# EAGLE design INCLINOMETRO_12 (EAGLE 7.6.0)
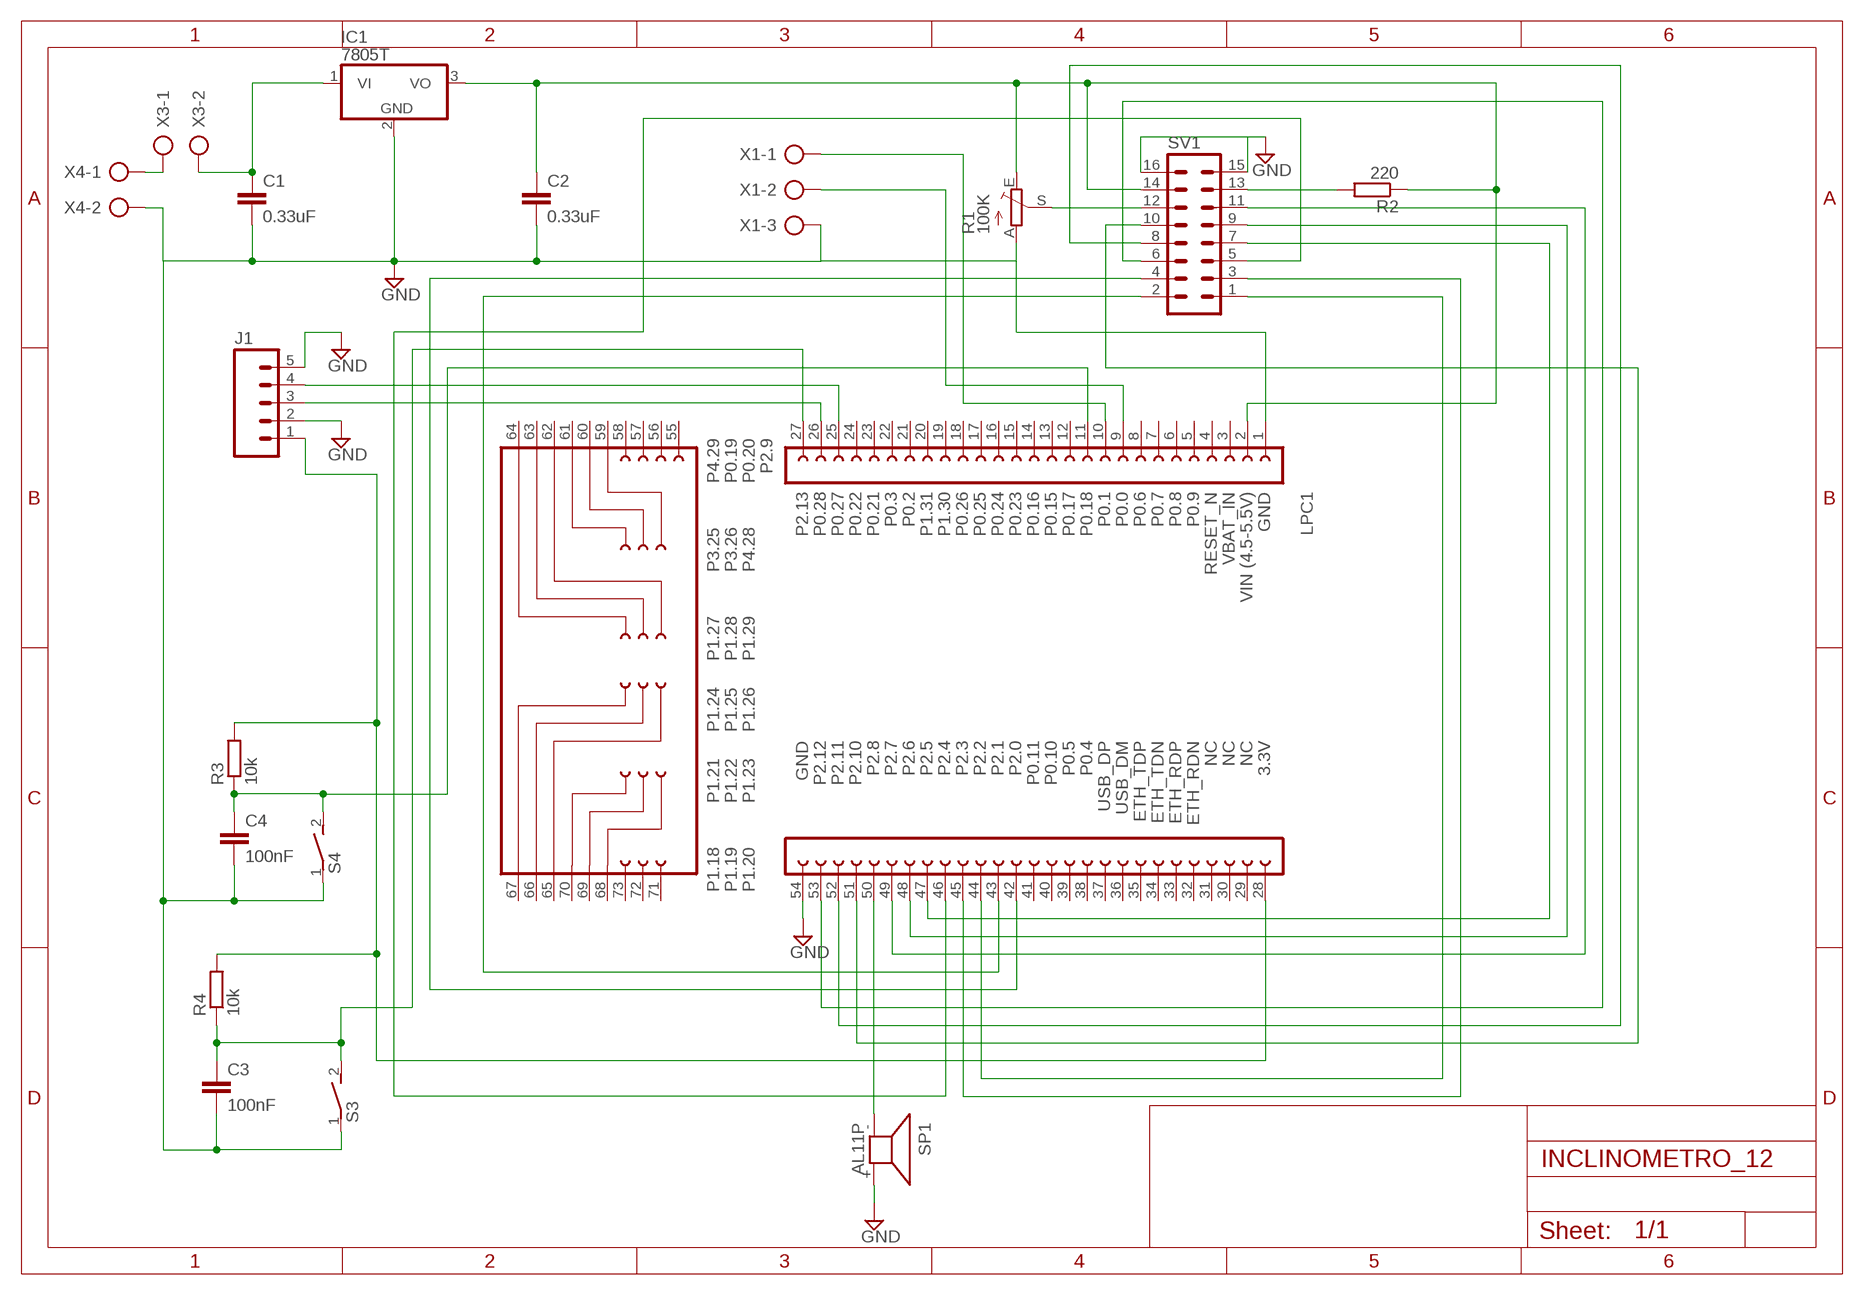
[diagram p0: schematic, sheet 1]

## Parts
C1  0.33uF  C-EU025-025X050  [C025-025X050]
C2  0.33uF  C-EU025-025X050  [C025-025X050]
C3  100nF  C-EU025-025X050  [C025-025X050]
C4  100nF  C-EU025-025X050  [C025-025X050]
IC1  7805T  [TO220H]
J1  M05PTH_LONGPADS  [1X05_LONGPADS]
LPC1  LPCXPRESSO_LPC1769  [LPCXPRESSO_LPC1769]
R1  100K  TRIM_EU-S64W  [S64W]
R2  220  R-EU_0207/12  [0207/12]
R3  10k  R-EU_0207/12  [0207/12]
R4  10k  R-EU_0207/12  [0207/12]
S3  DS01E  [DS-01]
S4  DS01E  [DS-01]
SP1  AL11P  [AL11P]
SV1  ML16  [ML16]
X1  AK500/3  [AK500/3]
X3  AK500/2  [AK500/2]
X4  AK500/2  [AK500/2]

## Nets
GND: LPC1.54
N$1: J1.3 LPC1.26
N$2: LPC1.50 SP1.-
N$3: J1.4 LPC1.25
N$4: C1.1 IC1.1(VI) X3.2
N$6: LPC1.52 SV1.8
N$7: X3.1 X4.1
N$8: R2.2 SV1.13
N$9: LPC1.9 X1.2
N$10: LPC1.10 X1.1
N$11: C3.1 LPC1.27 R4.1 S3.2
N$12: C2.1 IC1.3(VO) LPC1.2 R1.E R2.1 SV1.14
N$13: R1.S SV1.12
N$15: J1.1 LPC1.28 R3.2 R4.2
N$19: LPC1.43 SV1.2
N$20: LPC1.51 SV1.10
N$21: LPC1.53 SV1.6
N$22: LPC1.42 SV1.4
N$23: LPC1.49 SV1.11
N$24: LPC1.48 SV1.9
N$25: LPC1.45 SV1.3
N$26: LPC1.47 SV1.7
N$27: LPC1.46 SV1.5
N$28: LPC1.44 SV1.1
N$34: C4.1 LPC1.11 R3.1 S4.2
N$37: C1.2 C2.2 C3.2 C4.2 IC1.2(GND) J1.2 J1.5 LPC1.1 R1.A S3.1 S4.1 SP1.+ SV1.15 SV1.16 X1.3 X4.2 ; supply symbol labelled GND
Unconnected: LPC1.3 LPC1.4 LPC1.5 LPC1.6 LPC1.7 LPC1.8 LPC1.12 LPC1.13 LPC1.14 LPC1.15 LPC1.16 LPC1.17 LPC1.18 LPC1.19 LPC1.20 LPC1.21 LPC1.22 LPC1.23 LPC1.24 LPC1.29 LPC1.30 LPC1.31 LPC1.32 LPC1.33 LPC1.34 LPC1.35 LPC1.36 LPC1.37 LPC1.38 LPC1.39 LPC1.40 LPC1.41 LPC1.55 LPC1.56 LPC1.57 LPC1.58 LPC1.59 LPC1.60 LPC1.61 LPC1.62 LPC1.63 LPC1.64 LPC1.65 LPC1.66 LPC1.67 LPC1.68 LPC1.69 LPC1.70 LPC1.71 LPC1.72 LPC1.73

## Library data of the parts
C1-C4 = resistor:C-EU: CAPACITOR, European symbol
IC1 = linear:78*: Positive VOLTAGE REGULATOR Source: http://cache.national.com/ds/LM/LM78L05.pdf http://www.fairchildsemi.com/ds/LM/LM7805.pdf
J1 = SparkFun-Connectors:M05: Header 5 Standard 5-pin 0.1" header. Use with straight break away headers (SKU : PRT-00116), right angle break away headers (PRT-00553), swiss pins (PRT-00743), machine pins (PRT-00117), and female headers (PRT-00115). Molex polarized connector foot print use with SKU : PRT-08230 with associated crimp pins and housings.
LPC1 = LPCXpresso_boards:LPCXPRESSO_LPC1769
R1 = pot:TRIM_EU-: POTENTIOMETER
R2-R4 = resistor:R-EU_: RESISTOR, European symbol
S3 S4 = switch-dil:DS01E: DIL/CODE SWITCH; OC_FARNELL: unknown; OC_NEWARK: unknown
SP1 = buzzer:AL11P: SPEAKER Source: Buerklin; OC_FARNELL: unknown; OC_NEWARK: unknown
SV1 = con-ml:ML16: HARTING; OC_FARNELL: unknown; OC_NEWARK: unknown
X1 = con-ptr500:AK500/3: CONNECTOR; OC_FARNELL: unknown; OC_NEWARK: unknown
X3 X4 = con-ptr500:AK500/2: CONNECTOR; OC_FARNELL: unknown; OC_NEWARK: unknown

## Board
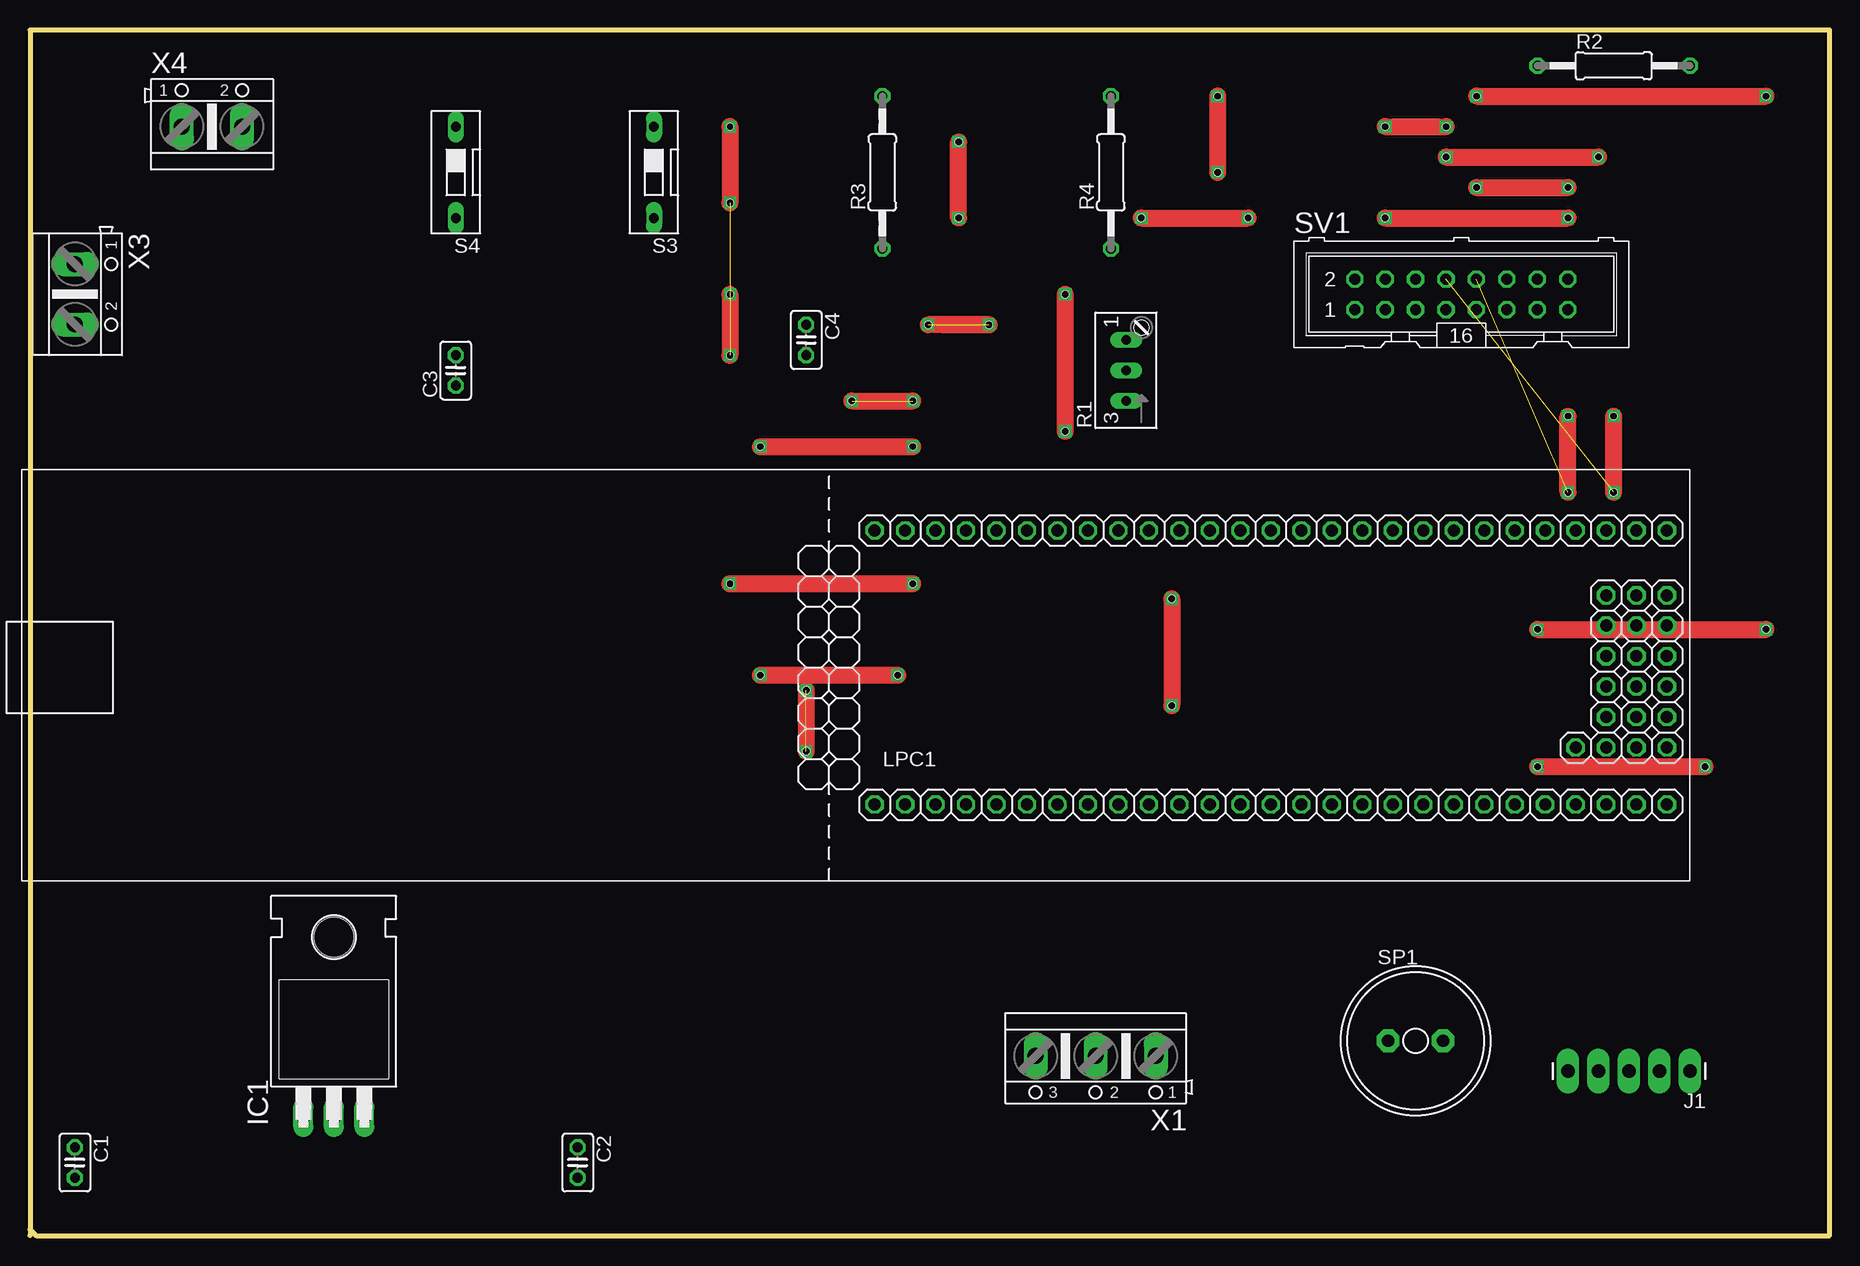
[diagram p1: board, top side]
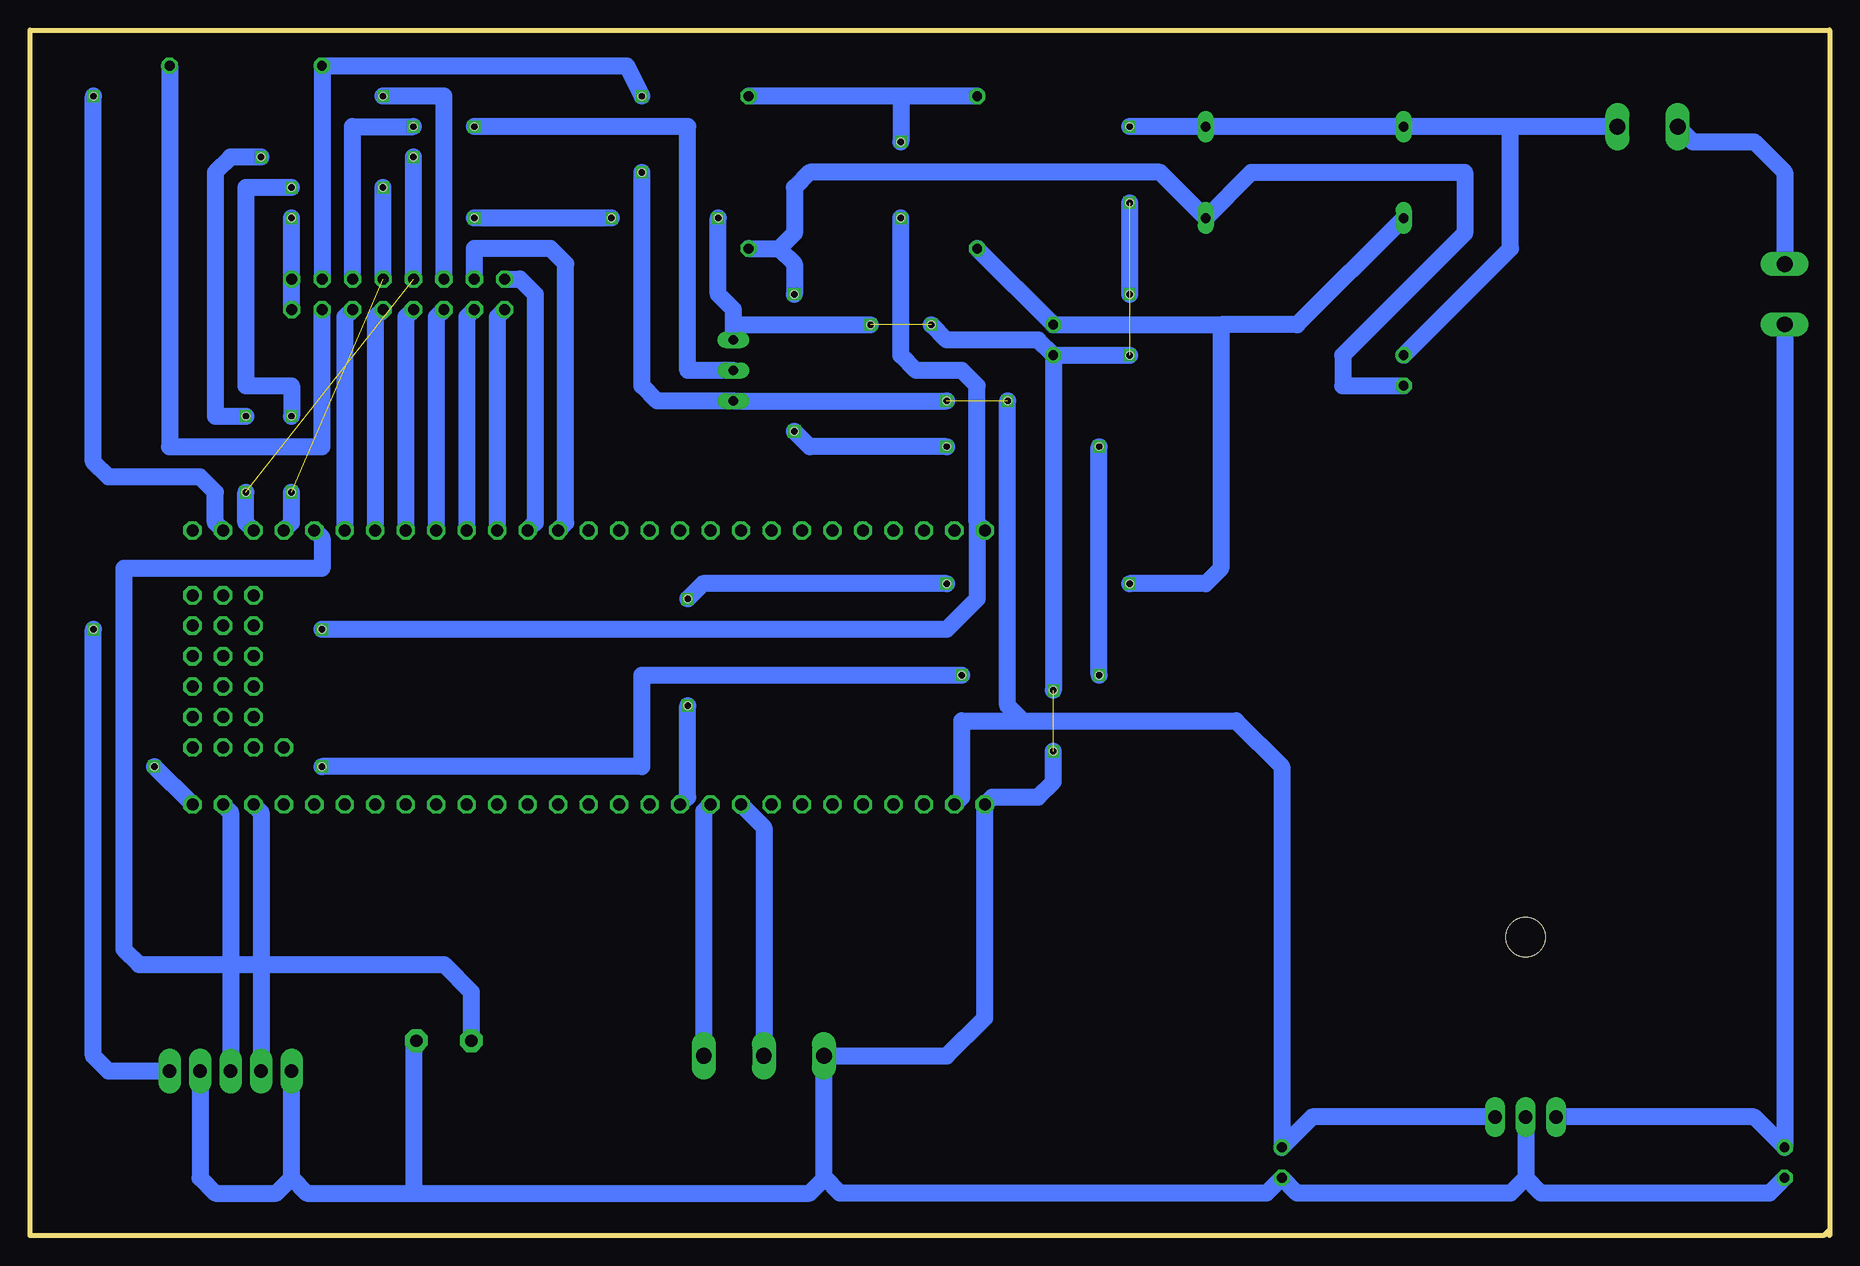
[diagram p2: board, bottom side, seen from below]

Size 150 x 100.5 mm. Coordinates in mm from the lower left corner, seen from the top.
Outline: 0,0.5 0.5,0 150,0 150,100.5 0,100.5 0,0
Copper layers (1*16): Top 0.035mm / dielectric 1.5mm / Bottom 0.035mm
Design rules "default": minimum track width 10mil, minimum drill 24mil, track to track 8mil, track to pad 8mil, pad to pad 8mil, via to via 8mil, smd to smd 8mil, copper to edge 40mil, drill to drill 8mil, minimum pad ring 10mil, minimum via ring 8mil, stop-mask expansion 4mil, vias tented up to drill 0mil, thermal gap 10mil
Holes 0.6 mm at 120.58,94.98 144.71,94.98 112.96,92.44 118.04,92.44 77.4,84.82 77.4,91.17 132.01,68.31 128.2,68.31 128.2,61.96 132.01,61.96 118.04,89.9 120.58,87.36 130.74,89.9 128.2,87.36 98.99,94.98 98.99,88.63 128.2,84.82 112.96,84.82 92.64,84.82 101.53,84.82 74.86,75.93 79.94,75.93 64.7,45.45 64.7,40.37 58.35,73.39 58.35,78.47 58.35,86.09 58.35,92.44 73.59,69.58 68.51,69.58 125.66,50.53 144.71,50.53 86.29,78.47 86.29,67.04 72.32,46.72 60.89,46.72 73.59,65.77 60.89,65.77 95.18,44.18 95.18,53.07 58.35,54.34 73.59,54.34 139.63,39.1 125.66,39.1

### Footprints (pad centres in the part's own frame; a part is rotated, then mirrored left to right if it is on the bottom)
C025-025X050 = drill 0.813 octagon: 1 -1.27,0; 2 1.27,0
TO220H = drill 1.118 long: 1 -2.54,-10.16; 2 0,-10.16; 3 2.54,-10.16 | hole 3.302: 0,4.826
1X05_LONGPADS = drill 1.118 pad 1.88 long: 1 0,0; 2 2.54,0; 3 5.08,0; 4 7.62,0; 5 10.16,0
LPCXPRESSO_LPC1769 = drill 1 octagon: 1 33.655,-5.715; 2 36.195,-5.715; 3 38.735,-5.715; 4 41.275,-5.715; 5 43.815,-5.715; 6 46.355,-5.715; 7 48.895,-5.715; 8 51.435,-5.715; 9 53.975,-5.715; 10 56.515,-5.715; 11 59.055,-5.715; 12 61.595,-5.715; 13 64.135,-5.715; 14 66.675,-5.715; 15 69.215,-5.715; 16 71.755,-5.715; 17 74.295,-5.715; 18 76.835,-5.715; 19 79.375,-5.715; 20 81.915,-5.715; 21 84.455,-5.715; 22 86.995,-5.715; 23 89.535,-5.715; 24 92.075,-5.715; 25 94.615,-5.715; 26 97.155,-5.715; 27 99.695,-5.715; 28 33.655,17.145; 29 36.195,17.145; 30 38.735,17.145; 31 41.275,17.145; 32 43.815,17.145; 33 46.355,17.145; 34 48.895,17.145; 35 51.435,17.145; 36 53.975,17.145; 37 56.515,17.145; 38 59.055,17.145; 39 61.595,17.145; 40 64.135,17.145; 41 66.675,17.145; 42 69.215,17.145; 43 71.755,17.145; 44 74.295,17.145; 45 76.835,17.145; 46 79.375,17.145; 47 81.915,17.145; 48 84.455,17.145; 49 86.995,17.145; 50 89.535,17.145; 51 92.075,17.145; 52 94.615,17.145; 53 97.155,17.145; 54 99.695,17.145; 55 92.075,-0.965; 56 94.615,-0.965; 57 97.155,-0.965; 58 99.695,-0.965; 59 94.615,1.575; 60 97.155,1.575; 61 99.695,1.575; 62 94.615,4.115; 63 97.155,4.115; 64 99.695,4.115; 65 94.615,6.655; 66 97.155,6.655; 67 99.695,6.655; 68 94.615,9.195; 69 97.155,9.195; 70 99.695,9.195; 71 94.615,11.735; 72 97.155,11.735; 73 99.695,11.735
S64W = drill 0.813 long: A 2.54,1.27; E -2.54,1.27; S 0,1.27
0207/12 = drill 0.813 octagon: 1 -6.35,0; 2 6.35,0
DS-01 = drill 0.813 long: 1 0,-3.81; 2 0,3.81
AL11P = drill 1.016 pad 1.905 octagon: + 2.286,0; - -2.286,0
ML16 = drill 0.914 octagon: 1 -8.89,-1.27; 2 -8.89,1.27; 3 -6.35,-1.27; 4 -6.35,1.27; 5 -3.81,-1.27; 6 -3.81,1.27; 7 -1.27,-1.27; 8 -1.27,1.27; 9 1.27,-1.27; 10 1.27,1.27; 11 3.81,-1.27; 12 3.81,1.27; 13 6.35,-1.27; 14 6.35,1.27; 15 8.89,-1.27; 16 8.89,1.27
AK500/3 = drill 1.321 long: 1 -5.004,0; 2 0,0; 3 5.004,0
AK500/2 = drill 1.321 long: 1 -2.515,0; 2 2.515,0

### Placement (x,y rotation side)
C1  3.74,6.08 270 top
C2  45.65,6.08 270 top
C3  35.49,72.12 90 top
C4  64.7,74.66 270 top
IC1  25.33,20.05 0 top
J1  138.36,13.7 180 top
LPC1  36.76,41.64 0 top
R1  92.64,72.12 90 top
R2  132.01,97.52 0 top
R3  71.05,88.63 90 top
R4  90.1,88.63 90 top
S3  52,88.63 180 top
S4  35.49,88.63 180 top
SP1  115.5,16.24 0 top
SV1  119.31,78.47 0 top
X1  88.83,14.97 180 top
X3  3.74,78.47 270 top
X4  15.17,92.44 0 top

### Tracks (layer width: path | path; a pad name or v marks a point on that pad's centre or on a via)
N$1
  Bottom 1.422: LPC1.26 133.28,35.29 J1.3
N$2
  Bottom 1.422: LPC1.50 125.66,58.15 125.66,55.61 142.17,55.61 142.17,23.86 140.9,22.59 115.5,22.59 113.21,20.3 SP1.-
N$3
  Bottom 1.422: LPC1.25 130.74,35.29 J1.4
N$4
  Bottom 1.422: X3.2 C1.1 6.28,9.89 IC1.1
N$5  (via drill 0.6)
  other vias: 77.4,91.17
N$6  (1 unrouted)
  Bottom 1.422: LPC1.52 132.01,59.42 132.01,61.96 | SV1.8 118.04,89.9
N$7
  Bottom 1.422: X4.1 11.38,91.17 6.28,91.17 3.74,88.63 X3.1
N$8
  Bottom 1.422: R2.2 138.36,65.77 125.66,65.77 SV1.13
N$9
  Bottom 1.422: LPC1.9 88.83,34.02 X1.2
N$10
  Bottom 1.422: LPC1.10 93.83,35.37 X1.1
N$11  (via drill 0.6)
  Top 1.422: v86.29,78.47 v86.29,67.04 | v60.89,46.72 v72.32,46.72 | v60.89,65.77 v73.59,65.77 | v125.66,39.1 v139.63,39.1
  Bottom 1.422: v73.59,65.77 85.02,65.77 v86.29,67.04 | C3.1 40.57,70.85 40.57,73.39 30.41,83.55 30.41,88.63 48.19,88.63 S3.2 55.81,88.63 85.02,88.63 86.29,87.36 86.29,83.55 87.56,82.28 | R4.1 87.56,82.28 | 87.56,82.28 86.29,81.01 v86.29,78.47 | LPC1.27 v139.63,39.1 | v72.32,46.72 98.99,46.72 98.99,39.1 v125.66,39.1 | v60.89,46.72 v60.89,65.77
N$12  (via drill 0.6)  (1 unrouted)
  Top 1.422: v98.99,94.98 v98.99,88.63
  Bottom 1.422: SV1.14 R2.1 100.26,97.52 v98.99,94.98 | IC1.3 43.11,9.89 C2.1 45.65,39.1 49.46,42.91 67.24,42.91 | LPC1.2 72.32,36.56 72.32,42.91 67.24,42.91 | v98.99,88.63 98.99,70.85 97.72,69.58 R1.E 73.59,69.58 | 67.24,42.91 68.51,44.18 68.51,69.58
N$13  (via drill 0.6)
  Top 1.422: v112.96,92.44 v118.04,92.44
  Bottom 1.422: SV1.12 123.12,92.44 v118.04,92.44 | R1.S 95.18,72.12 95.18,92.44 v112.96,92.44
N$14  (via drill 0.6)
  Top 1.422: v64.7,45.45 v64.7,40.37
N$15  (via drill 0.6)  (1 unrouted)
  Top 1.422: v77.4,84.82 77.4,91.17 | v125.66,50.53 v144.71,50.53
  Bottom 1.422: R3.2 77.4,94.98 | 77.4,94.98 R4.2 | LPC1.28 71.05,59.42 | 71.05,59.42 71.05,70.85 72.32,72.12 76.13,72.12 77.4,73.39 v77.4,84.82 | 77.4,94.98 77.4,91.17 | 71.05,59.42 71.05,53.07 73.59,50.53 v125.66,50.53 | J1.1 143.44,13.7 144.71,14.97 v144.71,50.53
N$19
  Bottom 1.422: SV1.2 109.15,79.74 107.88,78.47 107.88,59.42 LPC1.43
N$20  (1 unrouted)
  Bottom 1.422: LPC1.51 128.2,59.42 128.2,61.96 | SV1.10 120.58,87.36
N$21  (via drill 0.6)
  Top 1.422: v120.58,94.98 v144.71,94.98
  Bottom 1.422: SV1.6 115.5,94.98 v120.58,94.98 | LPC1.53 134.55,59.42 134.55,61.96 135.82,63.23 143.44,63.23 144.71,64.5 v144.71,94.98
N$22
  Bottom 1.422: LPC1.42 105.34,59.42 105.34,81.01 106.61,82.28 112.96,82.28 SV1.4
N$23
  Bottom 1.422: SV1.11 123.75,76.56 LPC1.49
N$24
  Bottom 1.422: SV1.9 121.22,76.56 LPC1.48
N$25
  Bottom 1.422: SV1.3 113.59,76.56 LPC1.45
N$26
  Bottom 1.422: SV1.7 118.67,76.56 LPC1.47
N$27
  Bottom 1.422: SV1.5 116.14,76.56 LPC1.46
N$28
  Bottom 1.422: SV1.1 111.06,76.56 LPC1.44
N$29  (via drill 0.6)
  Top 1.422: v118.04,89.9 v130.74,89.9 | v132.01,61.96 v132.01,68.31
  Bottom 1.422: v130.74,89.9 133.28,89.9 134.55,88.63 134.55,68.31 v132.01,68.31
N$30  (via drill 0.6)
  Top 1.422: v120.58,87.36 v128.2,87.36 | v128.2,61.96 v128.2,68.31
  Bottom 1.422: v128.2,87.36 132.01,87.36 132.01,70.85 128.2,70.85 v128.2,68.31
N$31  (via drill 0.6)
  Top 1.422: v58.35,78.47 v58.35,73.39
  Bottom 1.422: v58.35,86.09 v58.35,78.47
N$32  (via drill 0.6)
  Top 1.422: v68.51,69.58 v73.59,69.58
N$34  (via drill 0.6)
  Top 1.422: v95.18,53.07 v95.18,44.18 | v58.35,54.34 v73.59,54.34
  Bottom 1.422: S4.2 44.38,75.93 50.73,75.93 | R3.1 C4.1 50.73,75.93 | 50.73,75.93 50.73,55.61 52,54.34 v58.35,54.34 | LPC1.11 95.18,36.56 v95.18,44.18 | v73.59,54.34 93.91,54.34 v95.18,53.07
N$37  (via drill 0.6)  (3 unrouted)
  Top 1.422: v92.64,84.82 v101.53,84.82 | v112.96,84.82 v128.2,84.82 | v58.35,92.44 58.35,86.09
  Bottom 1.422: X4.2 26.6,92.44 | 26.6,92.44 S4.1 S3.1 v58.35,92.44 | C3.2 26.6,82.28 26.6,92.44 | SV1.16 SV1.15 v128.2,84.82 | J1.2 135.82,4.81 134.55,3.54 129.47,3.54 128.2,4.81 | 128.2,4.81 J1.5 | SP1.+ 118.04,15.99 118.04,3.54 | 118.04,3.54 85.02,3.54 83.83,4.73 83.83,4.81 | 83.83,4.81 X1.3 73.59,14.97 70.42,18.14 LPC1.1 69.78,36.56 65.97,36.56 64.7,37.83 64.7,40.37 | C1.2 5.01,3.54 24.06,3.54 25.33,4.81 | IC1.2 25.33,4.81 | 25.33,4.81 26.6,3.54 44.38,3.54 C2.2 46.92,3.54 82.48,3.54 83.75,4.81 83.83,4.81 | R1.A 91.37,75.93 | 91.37,75.93 91.37,77.2 92.64,78.47 v92.64,84.82 | v101.53,84.82 v112.96,84.82 | C4.2 65.97,74.66 73.59,74.66 74.86,75.93 | 91.37,75.93 79.94,75.93 | C4.2 64.7,45.45 | C4.2 58.35,73.39 | 128.2,4.81 126.93,3.54 118.04,3.54
N$39  (via drill 0.6)
  Top 1.422: 76.13,75.93 v79.94,75.93 v74.86,75.93